# EAGLE design tinyblick2 (EAGLE 9.6.2)
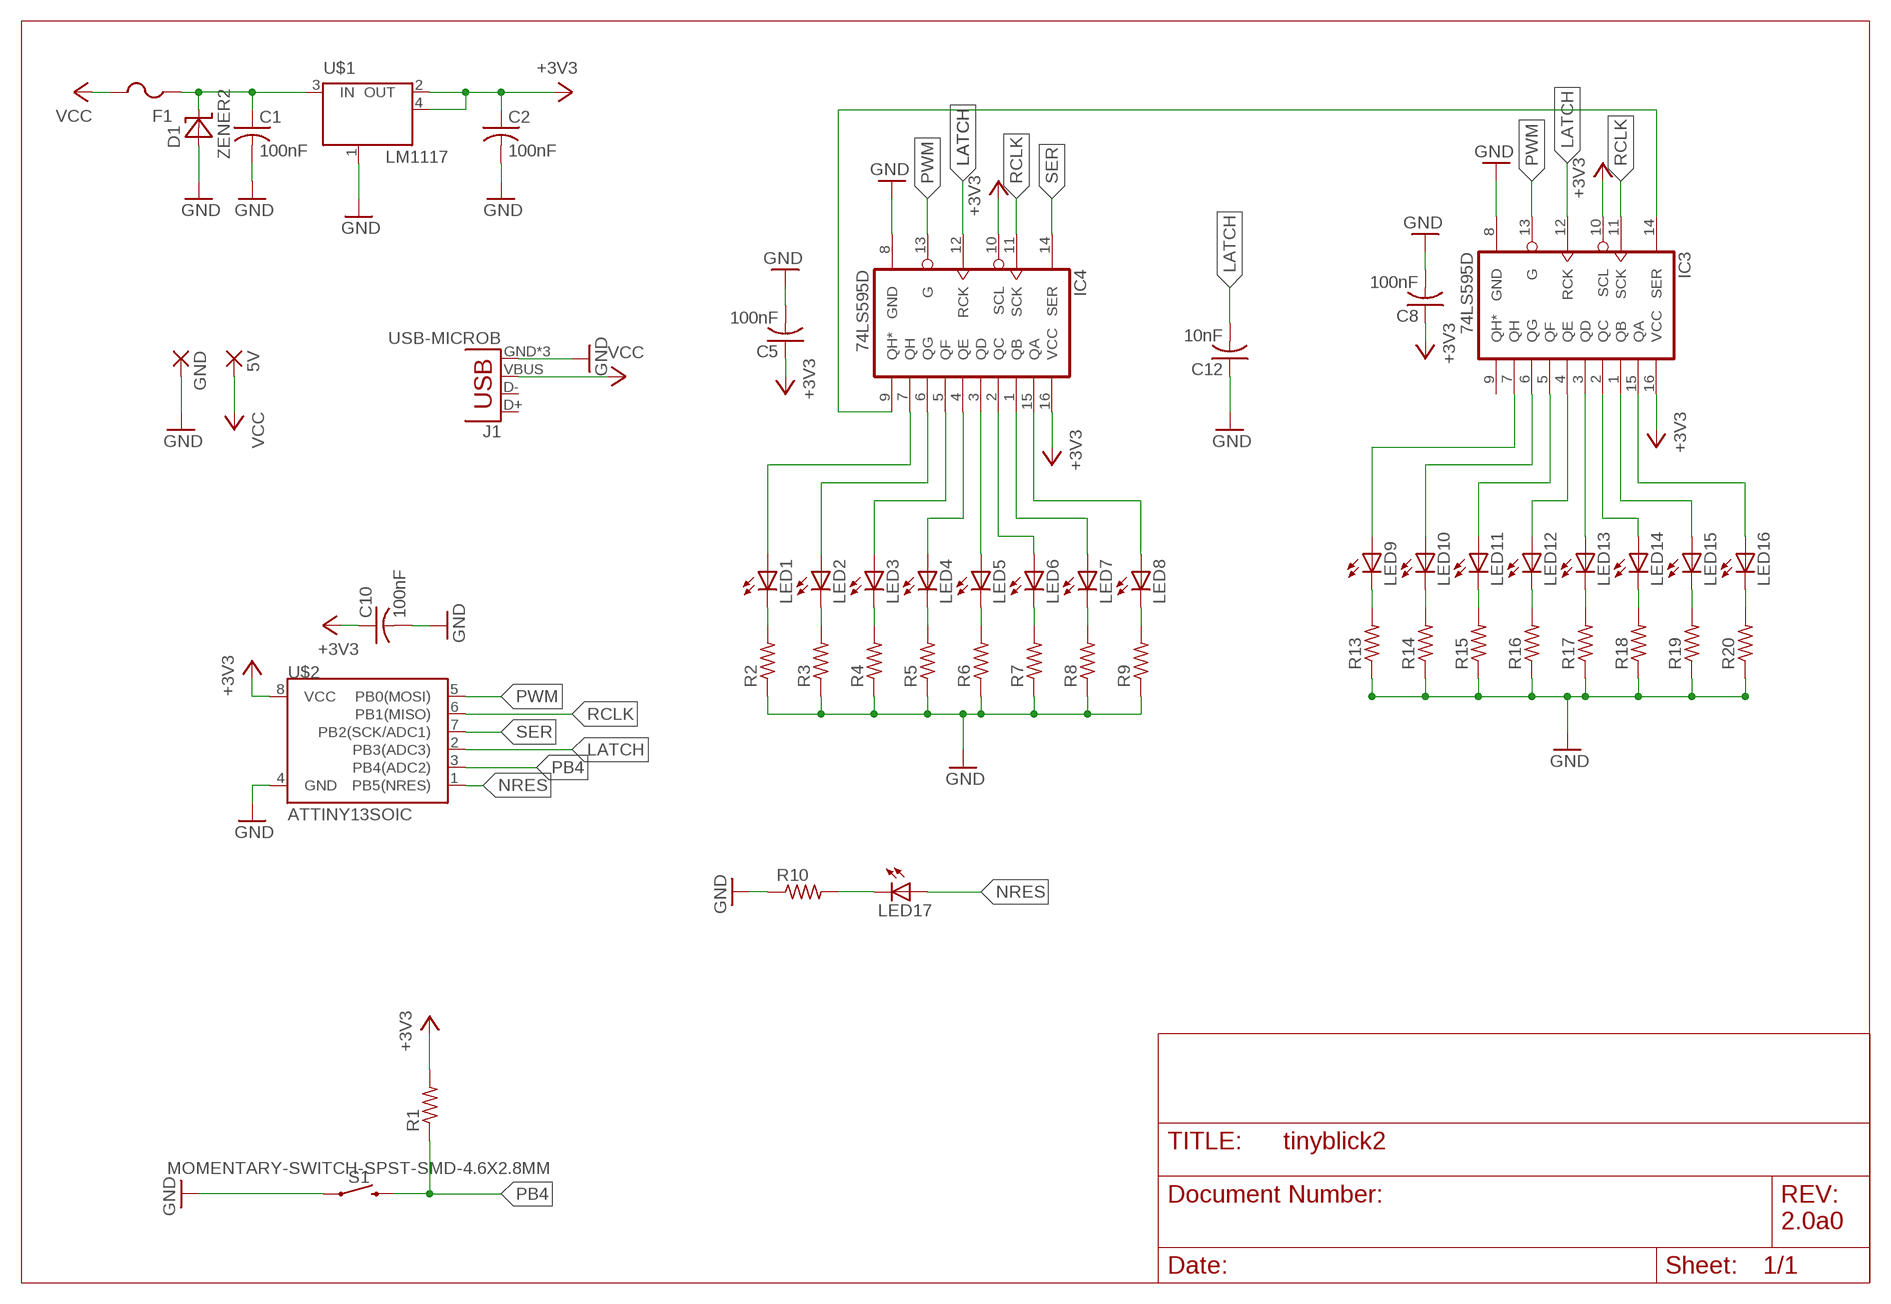
[diagram p0: schematic, sheet 1]

## Parts
5V  WIREPADSMD2,54-5,08  [SMD2,54-5,08]
C1  100nF  C-USC0603  [C0603]
C2  100nF  C-USC0603  [C0603]
C5  100nF  C-USC0603  [C0603]
C8  100nF  C-USC0603  [C0603]
C10  100nF  C-USC0603  [C0603]
C12  10nF  C-USC0603  [C0603]
D1  ZENER2  [SOD123]
F1  PTCFUSE-1206  [R1206]
GND  WIREPADSMD2,54-5,08  [SMD2,54-5,08]
IC3  74LS595D  [SO16]
IC4  74LS595D  [SO16]
J1  USB-MICROB  [USB-MICROB]
LED1  LEDCHIP-LED0603  [CHIP-LED0603]
LED2  LEDCHIP-LED0603  [CHIP-LED0603]
LED3  LEDCHIP-LED0603  [CHIP-LED0603]
LED4  LEDCHIP-LED0603  [CHIP-LED0603]
LED5  LEDCHIP-LED0603  [CHIP-LED0603]
LED6  LEDCHIP-LED0603  [CHIP-LED0603]
LED7  LEDCHIP-LED0603  [CHIP-LED0603]
LED8  LEDCHIP-LED0603  [CHIP-LED0603]
LED9  LEDCHIP-LED0603  [CHIP-LED0603]
LED10  LEDCHIP-LED0603  [CHIP-LED0603]
LED11  LEDCHIP-LED0603  [CHIP-LED0603]
LED12  LEDCHIP-LED0603  [CHIP-LED0603]
LED13  LEDCHIP-LED0603  [CHIP-LED0603]
LED14  LEDCHIP-LED0603  [CHIP-LED0603]
LED15  LEDCHIP-LED0603  [CHIP-LED0603]
LED16  LEDCHIP-LED0603  [CHIP-LED0603]
LED17  LEDCHIP-LED0603  [CHIP-LED0603]
R1  R-US_R0603  [R0603]
R2  R-US_R0603  [R0603]
R3  R-US_R0603  [R0603]
R4  R-US_R0603  [R0603]
R5  R-US_R0603  [R0603]
R6  R-US_R0603  [R0603]
R7  R-US_R0603  [R0603]
R8  R-US_R0603  [R0603]
R9  R-US_R0603  [R0603]
R10  R-US_R0603  [R0603]
R13  R-US_R0603  [R0603]
R14  R-US_R0603  [R0603]
R15  R-US_R0603  [R0603]
R16  R-US_R0603  [R0603]
R17  R-US_R0603  [R0603]
R18  R-US_R0603  [R0603]
R19  R-US_R0603  [R0603]
R20  R-US_R0603  [R0603]
S1  MOMENTARY-SWITCH-SPST-SMD-4.6X2.8MM  [TACTILE_SWITCH_SMD_4.6X2.8MM]
U$1  LM1117  [SOT223]
U$2  ATTINY13SOIC  [SO08]

## Nets
+3V3: C2.1 C5.1 C8.1 C10.1 IC3.10(SCL) IC3.16(VCC) IC4.10(SCL) IC4.16(VCC) R1.2 U$1.2(OUT) U$1.4(OUT) U$2.8(VCC)
GND: C1.2 C2.2 C5.2 C8.2 C10.2 C12.1 D1.A GND.1(P) IC3.8(GND) IC4.8(GND) J1.GND J1.MT1(GND) J1.MT2(GND) R2.1 R3.1 R4.1 R5.1 R6.1 R7.1 R8.1 R9.1 R10.1 R13.1 R14.1 R15.1 R16.1 R17.1 R18.1 R19.1 R20.1 S1.1 S1.2 U$1.1(GND/ADJ) U$2.4(GND)
LATCH: C12.2 IC3.12(RCK) IC4.12(RCK) U$2.2(PB3(ADC3))
N$1: LED1.C R2.2
N$2: LED17.C R10.2
N$4: LED2.C R3.2
N$7: LED3.C R4.2
N$9: LED9.C R13.2
N$10: LED4.C R5.2
N$13: LED5.C R6.2
N$15: IC4.3(QD) LED5.A
N$16: LED6.C R7.2
N$18: IC4.2(QC) LED6.A
N$19: LED7.C R8.2
N$21: IC4.1(QB) LED7.A
N$22: LED8.C R9.2
N$24: IC4.15(QA) LED8.A
N$25: IC4.7(QH) LED1.A
N$27: C1.1 D1.C F1.1 U$1.3(IN)
N$28: IC4.6(QG) LED2.A
N$29: IC4.5(QF) LED3.A
N$31: LED10.C R14.2
N$33: LED11.C R15.2
N$34: IC4.4(QE) LED4.A
N$36: LED12.C R16.2
N$38: LED13.C R17.2
N$45: IC3.3(QD) LED13.A
N$46: LED14.C R18.2
N$48: IC3.2(QC) LED14.A
N$49: LED15.C R19.2
N$51: IC3.1(QB) LED15.A
N$52: LED16.C R20.2
N$54: IC3.15(QA) LED16.A
N$55: IC3.7(QH) LED9.A
N$56: IC3.6(QG) LED10.A
N$57: IC3.5(QF) LED11.A
N$58: IC3.4(QE) LED12.A
N$60: IC3.14(SER) IC4.9(QH*)
NRES: LED17.A U$2.1(PB5(NRES))
PB4: R1.1 S1.3 S1.4 U$2.3(PB4(ADC2))
PWM: IC3.13(G) IC4.13(G) U$2.5(PB0(MOSI))
RCLK: IC3.11(SCK) IC4.11(SCK) U$2.6(PB1(MISO))
SER: IC4.14(SER) U$2.7(PB2(SCK/ADC1))
VCC: 5V.1(P) F1.2 J1.VBUS
Unconnected: IC3.9(QH*) J1.D+ J1.D-

## Notes on the sheet
- 2.0a0

## Library data of the parts
5V GND = wirepad:WIREPAD: Wire PAD connect wire on PCB
C1 C2 C5 C8 C10 C12 = adafruit:C-US: CAPACITOR, American symbol
D1 = smt_diodes:ZENER
F1 = adafruit:PTCFUSE: PTC fuses, resettable thermistors
IC3 = SparkFun:74*595: 8-bit SHIFT REGISTER, output latch
IC4 = SparkFun:74*595: 8-bit SHIFT REGISTER, output latch; SPICEPREFIX: X
J1 = SparkFun-Connectors:USB: USB Connectors USB-B-PTH is fully proven SKU : PRT-00139/CONN-08278 USB-miniB is fully proven SKU : PRT-00587 USB-A-PCB is untested. USB-A-H is throughly reviewed, but untested. Spark Fun Electronics SKU : PRT-00437 USB-B-SMT is throughly reviewed, but untested. Needs silkscreen touching up. USB-A-S has not been used/tested USB-MB-H has not been used/tested USB-MICROB has been used. CONN-09505; PROD_ID: CONN-09505
LED1-LED17 = led:LED: LED OSRAM: - CHIPLED LG R971, LG N971, LY N971, LG Q971, LY Q971, LO R971, LY R971 LH N974, LH R974 LS Q976, LO Q976, LY Q976 LO Q996 - Hyper CHIPLED LW Q18S LB Q993, LB Q99A, LB R99A - SideLED LS A670, LO A670, LY A670, LG A670, LP A670 LB A673, LV A673, LT A673, LW A673 LH A674 LY A675 LS A676, LA A676, LO A676, LY A676, LW A676 LS A679, LY A679, LG A679 - Hyper Micro SIDELED® LS Y876, LA Y876, LO Y876, LY Y876 LT Y87S - SmartLED LW L88C, LW L88S LB L89C, LB L89S, LG L890 LS L89K, LO L89K, LY L89K LS L896, LA L896, LO L896, LY L896 - TOPLED LS T670, LO T670, LY T670, LG T670, LP T670 LSG T670, LSP T670, LSY T670, LOP T670, LYG T670 LG T671, LOG T671, LSG T671 LB T673, LV T673, LT T673, LW T673 LH T674 LS T676, LA T676, LO T676, LY T676, LB T676, LH T676, LSB T676, LW T676 LB T67C, LV T67C, LT T67C, LS T67K, LO T67K, LY T67K, LW E67C LS E67B, LA E67B, LO E67B, LY E67B, LB E67C, LV E67C, LT E67C LW T67C LS T679, LY T679, LG T679 LS T770, LO T770, LY T770, LG T770, LP T770 LB T773, LV T773, LT T773, LW T773 LH T774 LS E675, LA E675, LY E675, LS T675 LS T776, LA T776, LO T776, LY T776, LB T776 LHGB T686 LT T68C, LB T68C - Hyper Mini TOPLED® LB M676 - Mini TOPLED Santana® LG M470 LS M47K, LO M47K, LY M47K Source: http://www.osram.convergy.de LUXEON: - LUMILED® LXK2-PW12-R00, LXK2-PW12-S00, LXK2-PW14-U00, LXK2-PW14-V00 LXK2-PM12-R00, LXK2-PM12-S00, LXK2-PM14-U00 LXK2-PE12-Q00, LXK2-PE12-R00, LXK2-PE12-S00, LXK2-PE14-T00, LXK2-PE14-U00 LXK2-PB12-K00, LXK2-PB12-L00, LXK2-PB12-M00, LXK2-PB14-N00, LXK2-PB14-P00, LXK2-PB14-Q00 LXK2-PR12-L00, LXK2-PR12-M00, LXK2-PR14-Q00, LXK2-PR14-R00 LXK2-PD12-Q00, LXK2-PD12-R00, LXK2-PD12-S00 LXK2-PH12-R00, LXK2-PH12-S00 LXK2-PL12-P00, LXK2-PL12-Q00, LXK2-PL12-R00 Source: www.luxeon.com KINGBRIGHT: KA-3528ASYC Source: www.kingbright.com
R1-R10 R13-R20 = adafruit:R-US_: RESISTOR, American symbol
S1 = SparkFun-Switches:MOMENTARY-SWITCH-SPST: Momentary Switch (Pushbutton) - SPST Normally-open (NO) SPST momentary switches (buttons, pushbuttons). Variants PTH-12MM - 12mm square, through-hole Momentary Pushbutton Switch - 12mm Square <https://www.sparkfun.com/products/9190> (COM-09190) PTH-6.0MM, PTH-6.0MM-KIT - 6.0mm square, through-hole Mini Pushbutton Switch <https://www.sparkfun.com/products/97> (COM-00097) KIT package intended for soldering kit's - only one side of pads' copper is exposed. PTH-RIGHT-ANGLE-KIT - Right-angle, through-hole Right Angle Tactile Button <https://www.sparkfun.com/products/10791> - Used on SparkFun BigTime Watch Kit <https://www.sparkfun.com/products/11734> SMD-12MM - 12mm square, surface-mount Tactile Button - SMD (12mm) <https://www.sparkfun.com/products/12993> (COM-12993) Used on SparkFun PicoBoard <https://www.sparkfun.com/products/11888> SMD-4.5MM - 4.5mm Square Trackball Switch Used on SparkFun Blackberry Trackballer Breakout <https://www.sparkfun.com/products/13169> SMD-4.6MMX2.8MM - 4.60mm x 2.80mm, surface mount Used on SparkFun Pro Micro - RP2040 <https://www.sparkfun.com/products/17717> SMD-5.2MM, SMD-5.2-REDUNDANT - 5.2mm square, surface-mount Mini Pushbutton Switch - SMD <https://www.sparkfun.com/products/8720> (COM-08720) Used on Arduino Pro Mini <https://www.sparkfun.com/products/11114> REDUNDANT package connects both switch circuits together SMD-6.0X3.5MM - 6.0 x 3.5mm, surface mount Momentary Reset Switch SMD <https://www.sparkfun.com/products/8229> (COM-08229) SMD-6.2MM-TALL - 6.2mm square, surface mount Tactile Button - SMD (6mm) <https://www.sparkfun.com/products/12992> Used on SparkFun Digital Sandbox <https://www.sparkfun.com/products/12651> SMD-RIGHT-ANGLE - Right-angle, surface mount Used on SparkFun Block for Intel® Edison - Arduino <https://www.sparkfun.com/products/13036>; PROD_ID: SWCH-15606
U$1 = voltage_regulators:LM1117
U$2 = SparkFun:ATTINY13

## Board
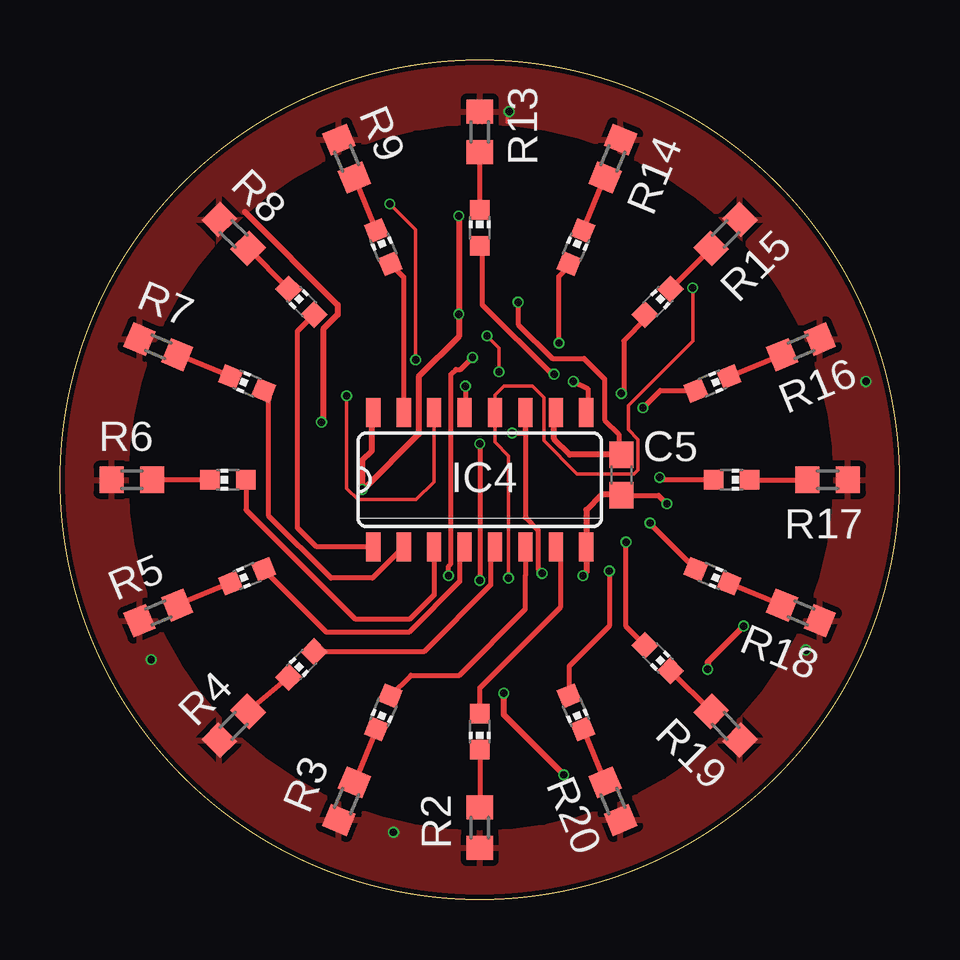
[diagram p1: board, top side]
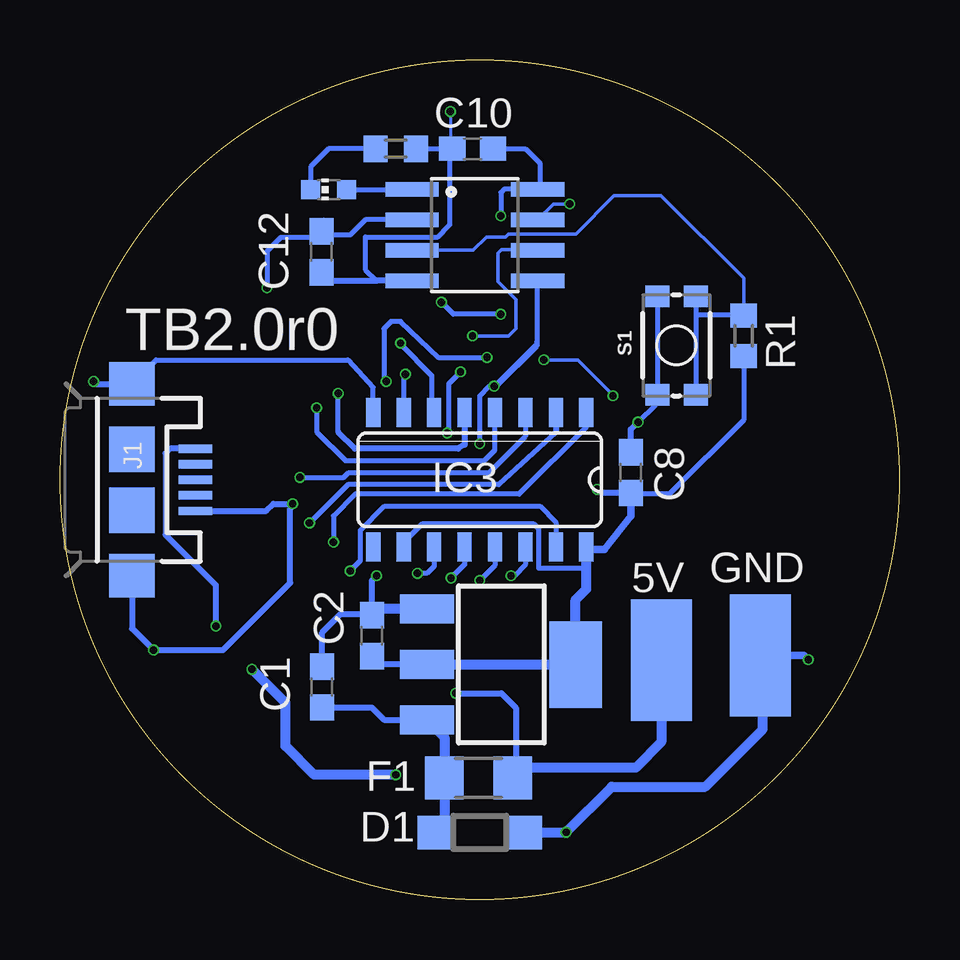
[diagram p2: board, bottom side, seen from below]

Size 35 x 35 mm. Coordinates in mm from the lower left corner, seen from the top.
Outline: circle at 17.5,17.5 radius 17.5
Copper layers (1*16): Top 0.035mm / dielectric 1.6mm / Bottom 0.035mm
Design rules "jlcpcb-2layers *": minimum track width 5mil, minimum drill 0.3mm, track to track 5mil, track to pad 5mil, pad to pad 5mil, via to via 5mil, smd to smd 5mil, copper to edge 0.2mm, drill to drill 6mil, minimum pad ring 10mil, minimum via ring 3mil, stop-mask expansion 4mil, vias tented up to drill 14mil, thermal gap 10mil

### Footprints (pad centres in the part's own frame; a part is rotated, then mirrored left to right if it is on the bottom)
SMD2,54-5,08 = smd 2.54 x 5.08: 1 0,0
C0603 = smd 1.1 x 1: 1 -0.85,0; 2 0.85,0
SOD123 = smd 1.4 x 1.4: A 1.9,0; C -1.9,0
R1206 = smd 1.6 x 1.803: 1 -1.422,0; 2 1.422,0
SO16 = smd 0.6 x 1.2: 1 -4.445,-2.8; 2 -3.175,-2.8; 3 -1.905,-2.8; 4 -0.635,-2.8; 5 0.635,-2.8; 6 1.905,-2.8; 7 3.175,-2.8; 8 4.445,-2.8; 9 4.445,2.8; 10 3.175,2.8; 11 1.905,2.8; 12 0.635,2.8; 13 -0.635,2.8; 14 -1.905,2.8; 15 -3.175,2.8; 16 -4.445,2.8
USB-MICROB = smd 0.35 x 1.4: D+ 0,2.65; D- -0.65,2.65; GND 1.3,2.65; ID 0.65,2.65; VBUS -1.3,2.65 | smd 1.8 x 1.9: MT1 -4,0; MT2 4,0 | smd 1.9 x 1.9: P$1 -1.27,0; P$2 1.27,0
CHIP-LED0603 = smd 0.8 x 0.8: A 0,-0.75; C 0,0.75
R0603 = smd 1 x 1.1: 1 -0.85,0; 2 0.85,0
TACTILE_SWITCH_SMD_4.6X2.8MM = smd 0.9 x 1: 1 -2.05,-0.8; 2 2.05,-0.8; 3 2.05,0.8; 4 -2.05,0.8
SOT223 = smd 1.219 x 2.235: 1 -2.311,-3.099; 2 0,-3.099; 3 2.311,-3.099 | smd 3.6 x 2.2: 4 0,3.099
SO08 = smd 0.61 x 2.21: 1 -1.905,-2.616; 2 -0.635,-2.616; 3 0.635,-2.616; 4 1.905,-2.616; 5 1.905,2.616; 6 0.635,2.616; 7 -0.635,2.616; 8 -1.905,2.616

### Placement (x,y rotation side)
5V  9.93,9.98 0 bottom
C1  24.07,8.86 90 bottom
C2  22,11 90 bottom
C5  23.4,17.7 270 top
C8  11.2,17.8 90 bottom
C10  17.8,31.3 180 bottom
C12  24.1,27 90 bottom
D1  17.5,2.8 0 bottom
F1  17.55,5.07 0 bottom
GND  5.81,10.18 0 bottom
IC3  17.5,17.5 180 bottom
IC4  17.5,17.5 0 top
J1  32,17.5 270 bottom
LED1  17.5,7 180 top
LED2  13.48,7.8 157.5 top
LED3  10.07,9.8 135 top
LED4  7.8,13.48 112.5 top
LED5  7,17.5 90 top
LED6  7.8,21.51 67.5 top
LED7  10.07,24.92 45 top
LED8  13.48,27.2 22.5 top
LED9  17.5,28 0 top
LED10  21.51,27.2 337.5 top
LED11  24.92,24.92 315 top
LED12  27.2,21.51 292.5 top
LED13  28,17.5 270 top
LED14  27.2,13.48 247.5 top
LED15  24.92,10.07 225 top
LED16  21.51,7.8 202.5 top
LED17  23.8,29.6 90 bottom
R1  6.5,23.5 270 bottom
R2  17.5,3 90 top
R3  11.95,4.1 67.5 top
R4  7.24,7.24 45 top
R5  4.1,11.95 22.5 top
R6  3,17.5 0 top
R7  4.1,23.04 337.5 top
R8  7.24,27.75 315 top
R9  11.95,30.89 292.5 top
R10  21,31.3 180 bottom
R13  17.5,32 270 top
R14  23.05,30.89 247.5 top
R15  27.75,27.75 225 top
R16  30.89,23.04 202.5 top
R17  32,17.5 180 top
R18  30.89,11.95 157.5 top
R19  27.75,7.24 135 top
R20  23.05,4.1 112.5 top
S1  9.3,23.1 270 bottom
U$1  16.6,9.8 270 bottom
U$2  17.7,27.7 270 bottom

### Tracks (layer width: path | path; a pad name or v marks a point on that pad's centre or on a via)
+3V3  (via drill 0.3)
  Top 0.203: 23.3,18.8 23.3,19.4 22.7,20 22.7,21.7 21.84,22.55 20.52,22.55 19.1,23.98 v19.1,24.9
  Top 0.254: IC4.16 13,20.25 13,18.7 12.6,18.3 v12.6,17.1 12.65,17.1 14.95,19.4 14.95,21.8 16.62,23.47 v16.62,24.4 v16.62,28.5 | IC4.10 20.6,20.23 20.6,19.2 21.25,18.55 C5.1 23.3,18.65 23.3,18.8
  Bottom 0.127: 15.12,29.5 15.38,29.75 U$2.8 15.12,29.5
  Bottom 0.203: 13.1,13.82 15.04,13.82 15.04,15.44 15.24,15.65 19.91,15.65 20.73,14.83 | C8.1 11.15,16.9 9.6,16.9 6.5,20 R1.2 | C10.1 15.6,31.3 15,30.7 15,29.62 15.12,29.5 | U$2.8 16.5,29.61 16.62,29.48 v16.62,28.5 | v16.62,24.4 18.6,24.4 v19.1,24.9
  Bottom 0.254: 14,9.8 U$1.4 | U$1.2 21.65,9.8 C2.1 | C8.1 12.45,16.95 v12.6,17.1 | 20.73,14.83 IC3.10
  Bottom 0.305: 13.1,14.64 13.1,13.82 13.1,12.9 | 13.1,14.64 IC3.16 | C8.1 11.2,16 12.3,14.6 13.05,14.6 13.1,14.64
  Bottom 0.406: U$1.4 13.5,12.5 13.1,12.9 13.05,12.95 IC3.16 | U$1.2 14,9.8
GND  (via drill 0.3)
  Top 0.127: v18.73,32.85 18.63,32.75 18.63,32.4
  Top 0.203: C5.2 24.95,16.85 v25.3,16.5
  Top 0.254: C5.2 23.35,16.9 22.6,16.9 21.95,16.25 IC4.8 21.95,13.64 v21.8,13.5 | v10.9,19.9 10.97,19.91 10.97,23.77 11.58,24.38 11.58,24.79 7.72,28.65 7.7,28.67 | R17.1 32.85,17.15
  Bottom 0.127: 10.12,21 S1.2 | 18.75,31.2 18.75,31.25 C10.2 18.73,31.38 v18.73,32.85 | 18.79,28.09 18.75,28.12
  Bottom 0.152: 18.8,31.3 18.75,31.25
  Bottom 0.2: 10.12,21 10.16,20.96 10.16,20.8 | R10.1 18.8,31.3
  Bottom 0.203: IC3.8 21.95,21.34 23,22.5 31,22.5 J1.MT1 | v10.9,19.9 10.16,20.64 10.16,20.8 | 23.98,26.02 C12.1 | 18.79,28.09 19.25,27.62 22.27,27.62 22.27,26.27 21.8,25.8 | 18.75,28.12 18.75,31.2 | S1.1 S1.2
  Bottom 0.254: C1.2 24.07,11.13 23.3,11.9 22.05,11.9 C2.2 22,13.3 v21.8,13.5 | C8.2 11.2,19.6 v10.9,19.9 | J1.MT2 32,11.3 v31.1,10.4 28.2,10.4 25.4,13.2 25.4,16.3 25.3,16.4 v25.3,16.5 26.1,16.5 26.4,16.2 J1.GND | J1.MT1 33.5,21.5 v33.6,21.6 | U$2.4 21.8,25.8 23.98,25.8 23.98,26.02
  Bottom 0.305: GND.1 3.98,10.18 v3.8,10
  Bottom 0.406: D1.A v13.9,2.8 12,4.7 8.1,4.7 5.7,7.1 5.7,10.07 GND.1 | U$1.1 21.74,12.11 C2.2
  pour Top: -0.6,35 36.1,35 36.1,-0.2 -0.6,-0.2
LATCH  (via drill 0.3)
  Top 0.152: v26.38,25.5 26.38,23.27 23.7,20.6 23.7,19.59 24.1,19.18 24.1,17.92 23.94,17.75 21.55,17.75 20.17,19.12 20.17,20.93 19.7,21.4 18.5,21.4 18.14,21.04 IC4.12 18.14,19.07 18.7,18.5 v18.7,13.4
  Bottom 0.127: 24,28.38 24,27.88 C12.2 24,28.38
  Bottom 0.203: C12.2 24.23,27.73 | 24.23,27.73 24.35,27.6 25.8,27.6 26.38,27.02 v26.38,25.5 | U$2.2 22.27,28.34 22.9,27.7 24.2,27.7 24.23,27.73 | IC3.12 18.14,13.96 v18.7,13.4
N$1
  Top 0.203: LED1.C R2.2
N$2
  Bottom 0.2: R10.2 23.8,31.3 24.55,30.55 LED17.C
N$4
  Top 0.203: LED2.C R3.2
N$5
  cutout Top: 17.5,32.2 arc-90 32.1,17.5 arc-90 17.5,3 arc-90 3,17.5 arc-90
N$7
  Top 0.203: LED3.C R4.2
N$9
  Top 0.203: LED9.C R13.2
N$10
  Top 0.203: LED4.C R5.2
N$13
  Top 0.203: LED5.C R6.2
N$15
  Top 0.203: IC4.3 15.6,12.7 14.6,11.7 12.3,11.7 7.75,16.25 LED5.A
N$16
  Top 0.203: LED6.C R7.2
N$18
  Top 0.203: IC4.2 13.03,13.4 11.3,13.4 8.7,16 8.7,20.9
  Top 0.254: 8.7,20.9 8.7,21.02 LED6.A
N$19
  Top 0.203: LED7.C R8.2
N$21
  Top 0.203: IC4.1 10.7,14.7 9.9,15.5 9.9,23.69 10.46,24.25
  Top 0.254: 10.46,24.25 LED7.A
N$22
  Top 0.203: LED8.C R9.2
N$24
  Top 0.203: LED8.A 14.32,25.95 IC4.15
N$25
  Top 0.203: IC4.7 20.88,14.5 20.88,12.2 17.5,8.82 LED1.A
N$27
  Bottom 0.254: 18.97,3.23 D1.C | C1.1 22.01,8.01 21.5,7.5 U$1.3
  Bottom 0.406: U$1.3 18.97,6.76 F1.1 18.97,3.23
N$28
  Top 0.203: LED2.A 14.62,9.35 16.65,9.35 19.41,12.11 19.41,13.51 IC4.6
N$29
  Top 0.203: IC4.5 17.96,14.52 17.96,13.11 15.18,10.33 LED3.A
N$31
  Top 0.203: LED10.C R14.2
N$33
  Top 0.203: LED11.C R15.2
N$34
  Top 0.203: IC4.4 16.66,14.49 16.66,13.25 14.55,11.14 11.12,11.14 LED4.A
N$36
  Top 0.203: LED12.C R16.2
N$38
  Top 0.203: LED13.C R17.2
N$45  (via drill 0.3)
  Top 0.203: LED13.A 25.1,17.5 v25,17.6
  Bottom 0.203: IC3.3 15.6,19.3 17.1,17.8 22.97,17.8 23.17,17.6 v25,17.6
N$46
  Top 0.203: LED14.C R18.2
N$48  (via drill 0.3)
  Top 0.203: LED14.A 24.6,15.67 v24.6,15.7
  Bottom 0.203: 16.7,17.3 23,17.3 v24.6,15.7
  Bottom 0.208: 14.32,19.48 16.7,17.3
  Bottom 0.254: IC3.2 14.32,19.48
N$49
  Top 0.203: LED15.C R19.2
N$51  (via drill 0.3)
  Top 0.203: LED15.A 23.6,11.39 v23.6,14.9
  Bottom 0.203: 13.05,20.1 13.05,19.7 15.86,16.9 22.7,16.9 23.6,16 v23.6,14.9
  Bottom 0.254: 13.05,20.1 IC3.1
N$52
  Top 0.203: LED16.C R20.2
N$54  (via drill 0.3)
  Top 0.203: LED16.A 21.22,9.72 22.9,11.4 v22.9,13.7
  Bottom 0.203: v22.9,13.7 22.47,14.13 22.47,15.39 21.47,16.4 15,16.4 14.32,15.72 IC3.15
N$55  (via drill 0.3)
  Top 0.203: v20.6,21.9 20.5,21.9 17.6,24.8 17.6,27.15 LED9.A
  Bottom 0.203: v20.6,21.9 20.68,21.82 IC3.7
N$56  (via drill 0.3)
  Top 0.203: v20.8,23.2 20.8,25.98 21.22,26.4
  Top 0.254: 21.22,26.4 LED10.A
  Bottom 0.203: v20.8,23.2 20.8,23.15 19.5,21.85 19.5,20.4 IC3.6
N$57  (via drill 0.3)
  Top 0.203: LED11.A 24.39,24.19 23.5,23.3 23.5,21.2 v23.4,21.1
  Bottom 0.203: 23.4,19.5 v23.4,21.1
  Bottom 0.254: IC3.5 18.14,18.96 18.4,18.8 22.7,18.8 23.4,19.5
N$58  (via drill 0.3)
  Top 0.203: v24.3,20.5 25.02,21.22 LED12.A
  Bottom 0.203: v24.3,20.5 24.3,19.5 23.1,18.3 17.3,18.3 16.86,18.73 IC3.4
N$60  (via drill 0.3)
  Top 0.203: v16.2,13.5 16.2,13.9 16.3,14 16.3,21.9 16.5,22.1 16.7,22.1 v17.2,22.6 | v21.4,21.6 22,21.3 22,20.36 IC4.9
  Bottom 0.203: v21.4,21.6 21.5,21.6 21.5,23.8 21.2,24.1 20.8,24.1 19.23,22.6 v17.2,22.6 | IC3.14 15.6,13.97 16.06,13.5 v16.2,13.5
NRES
  Bottom 0.152: 20.7,29.61 U$2.1
  Bottom 0.2: LED17.A 20.7,29.6 20.7,29.61
PB4
  Bottom 0.127: S1.4 8.5,24.38 | 8.5,24.38 S1.3 | 8.5,24.38 8.4,24.38 6.5,24.38 R1.1
  Bottom 0.152: R1.1 6.5,25.9 9.94,29.34 11.91,29.34 13.5,27.75 16.3,27.75 16.43,27.62 17.23,27.62 17.79,27.07 U$2.3
  Bottom 0.203: S1.4 S1.3 | R1.1 6.53,24.38 8.4,24.38
PWM  (via drill 0.3)
  Top 0.203: v16.9,21.4 16.9,20.34 IC4.13 | v17.5,19 v17.5,13.3
  Bottom 0.127: 14.89,25.99 15,25.88 U$2.5 | 15.12,23.25 16.88,21.5 v16.9,21.4
  Bottom 0.203: U$2.5 15.12,25.75 15.12,23.25 15.12,23.07 16.8,21.4 v16.9,21.4 17.1,21.4 17.5,21 v17.5,19 | 14.7,25.8 14.89,25.99 | IC3.13 16.86,13.94 v17.5,13.3
RCLK  (via drill 0.3)
  Top 0.152: v17.8,23.5 18.3,23 v18.3,22
  Top 0.203: v18.85,19.45 19.35,19.45 19.41,19.5 IC4.11 19.41,15.92 19.93,15.39 19.93,13.77 v20.1,13.6
  Bottom 0.127: 15,27.12 U$2.6
  Bottom 0.152: 15.8,27.1 16.6,27.1 16.75,26.95 16.75,25.76 16,25.01 16,23.8 16.3,23.5 v17.8,23.5
  Bottom 0.203: 14.97,27.1 15,27.12 | U$2.6 15.22,26.92 15.4,27.1 15.8,27.1 | v18.3,22 18.8,21.5 18.8,19.51 v18.85,19.45 | v20.1,13.6 19.7,13.6 19.41,13.89 IC3.11
SER  (via drill 0.3)
  Top 0.152: v11.95,21 11.95,17.14 12.42,16.67 14.85,16.67 15.6,17.41 15.6,20 | v14.83,22.5 14.83,27.92 v13.75,29
  Top 0.203: 15.6,20 IC4.14
  Bottom 0.152: 14.8,22.5 v14.83,22.5 13.4,22.5 11.9,21 v11.95,21 | U$2.7 14.42,29 v13.75,29
VCC  (via drill 0.3)
  Top 0.254: v28.5,11.4 27,9.9 v27,9.6 | v21,5.2 18.5,7.7 v18.5,8.6
  Bottom 0.254: J1.VBUS 30.4,18.8 30.6,18.6 30.6,15.2 28.5,13.1 v28.5,11.4 | v18.5,8.6 16.6,8.6 16,8 16,5.2
  Bottom 0.406: 5V.1 9.93,6.57 11,5.5 15.7,5.5 16,5.2 F1.2 | v21,5.2 24.4,5.2 25.6,6.4 25.6,7.6 25.6,8.2 v27,9.6

### Text on the board
bPlace: TB2.0r0